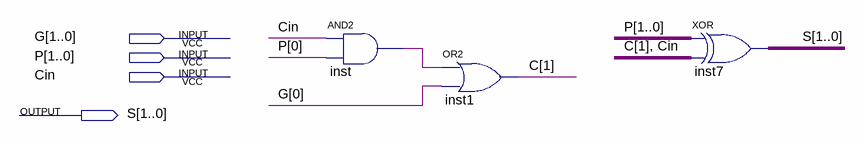
[diagram p0: schematic sheet]
// Quartus schematic CLA_2bit_Logic_No_Cout.bdf as structural Verilog: 3 symbols, 4 pins
module CLA_2bit_Logic_No_Cout (
  input  [1:0] G,
  input  [1:0] P,
  input  Cin,
  output [1:0] S
);

  wire inst_out;
  wire [1:1] C;

  and inst (inst_out, Cin, P[0]);
  or inst1 (C[1], inst_out, G[0]);
  assign S = P ^ {C[1], Cin};  // XOR inst7, 2 bits wide
endmodule
